# Altium project PCB1_Project.PrjPcb
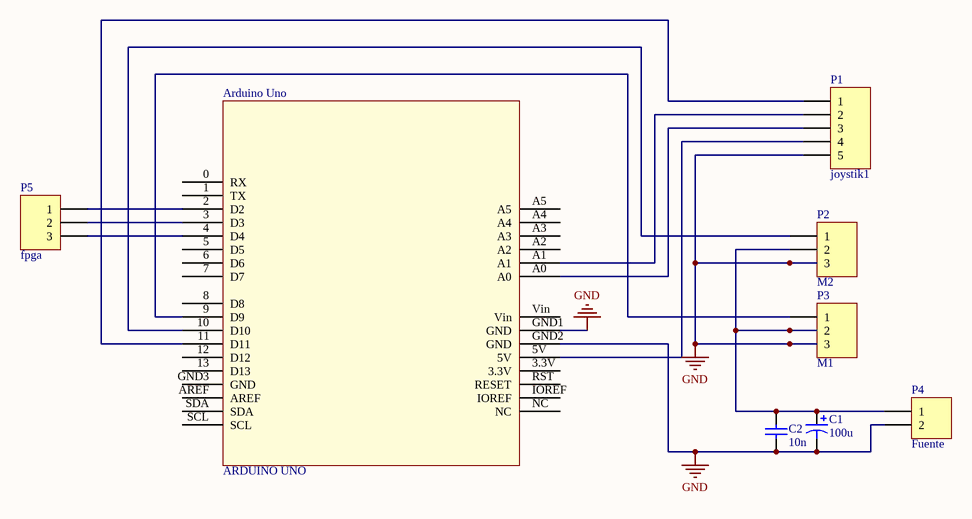
[diagram p0: Sheet1.SchDoc]
2 sheets, 15 parts. Net scope: flat (ports and power ports of the same name join across sheets).
Board files: PCB1.PcbDoc, PCB2.PcbDoc
Sheets:
  Sheet1.SchDoc
  Sheet2.SchDoc

## Sheet Sheet1.SchDoc
size A4; SheetNumber: 1; SheetTotal: 2

### Parts
Arduino_Uno  ARDUINO UNO  [ARDUINO UNO]
C1  value 100u  [CAP ELEC 10x16x5]  (hidden comment: Capacitor polarizado)
C2  value 10n  [Capacitor ceramico 0.2 inch pitch]  (hidden comment: Capacitor no polarizado)
P1  joystik1  [HDR1X5]
P2  M2  [HDR1X3]
P3  M1  [HDR1X3]
P4  Fuente  [HDR1X2]
P5  fpga  [HDR1X3]

### Nets
GND: Arduino_Uno.GND1(GND) Arduino_Uno.GND2(GND) C1.2 C2.1 P1.5 P2.3 P3.3 P4.2
NetArduino_Uno_2: Arduino_Uno.2(D2) P5.1
NetArduino_Uno_3: Arduino_Uno.3(D3) P5.2
NetArduino_Uno_4: Arduino_Uno.4(D4) P5.3
NetArduino_Uno_5V: Arduino_Uno.5V P1.4
NetArduino_Uno_9: Arduino_Uno.9(D9) P3.1
NetArduino_Uno_10: Arduino_Uno.10(D10) P2.1
NetArduino_Uno_11: Arduino_Uno.11(D11) P1.1
NetArduino_Uno_A0: Arduino_Uno.A0 P1.3
NetArduino_Uno_A1: Arduino_Uno.A1 P1.2
NetC1_1: C1.1 C2.2 P2.2 P3.2 P4.1

Not connected (* = marked no-connect by the designer): Arduino_Uno 0(RX) 1(TX) 3.3V 5(D5) 6(D6) 7(D7) 8(D8) 12(D12) 13(D13) A2 A3 A4 A5 AREF GND3(GND) IOREF NC RST(RESET) SCL SDA Vin

### Library data of the parts
P1 = Header 5: Header, 5-Pin; LatestRevisionDate: 17-Jul-2002; LatestRevisionNote: Re-released for DXP Platform.; Publisher: Altium Limited
P2 P3 P5 = Header 3: Header, 3-Pin; LatestRevisionDate: 17-Jul-2002; LatestRevisionNote: Re-released for DXP Platform.; Publisher: Altium Limited
P4 = Header 2: Header, 2-Pin; LatestRevisionDate: 17-Jul-2002; LatestRevisionNote: Re-released for DXP Platform.; Publisher: Altium Limited

## Sheet Sheet2.SchDoc
size A4; SheetNumber: 2; SheetTotal: 2
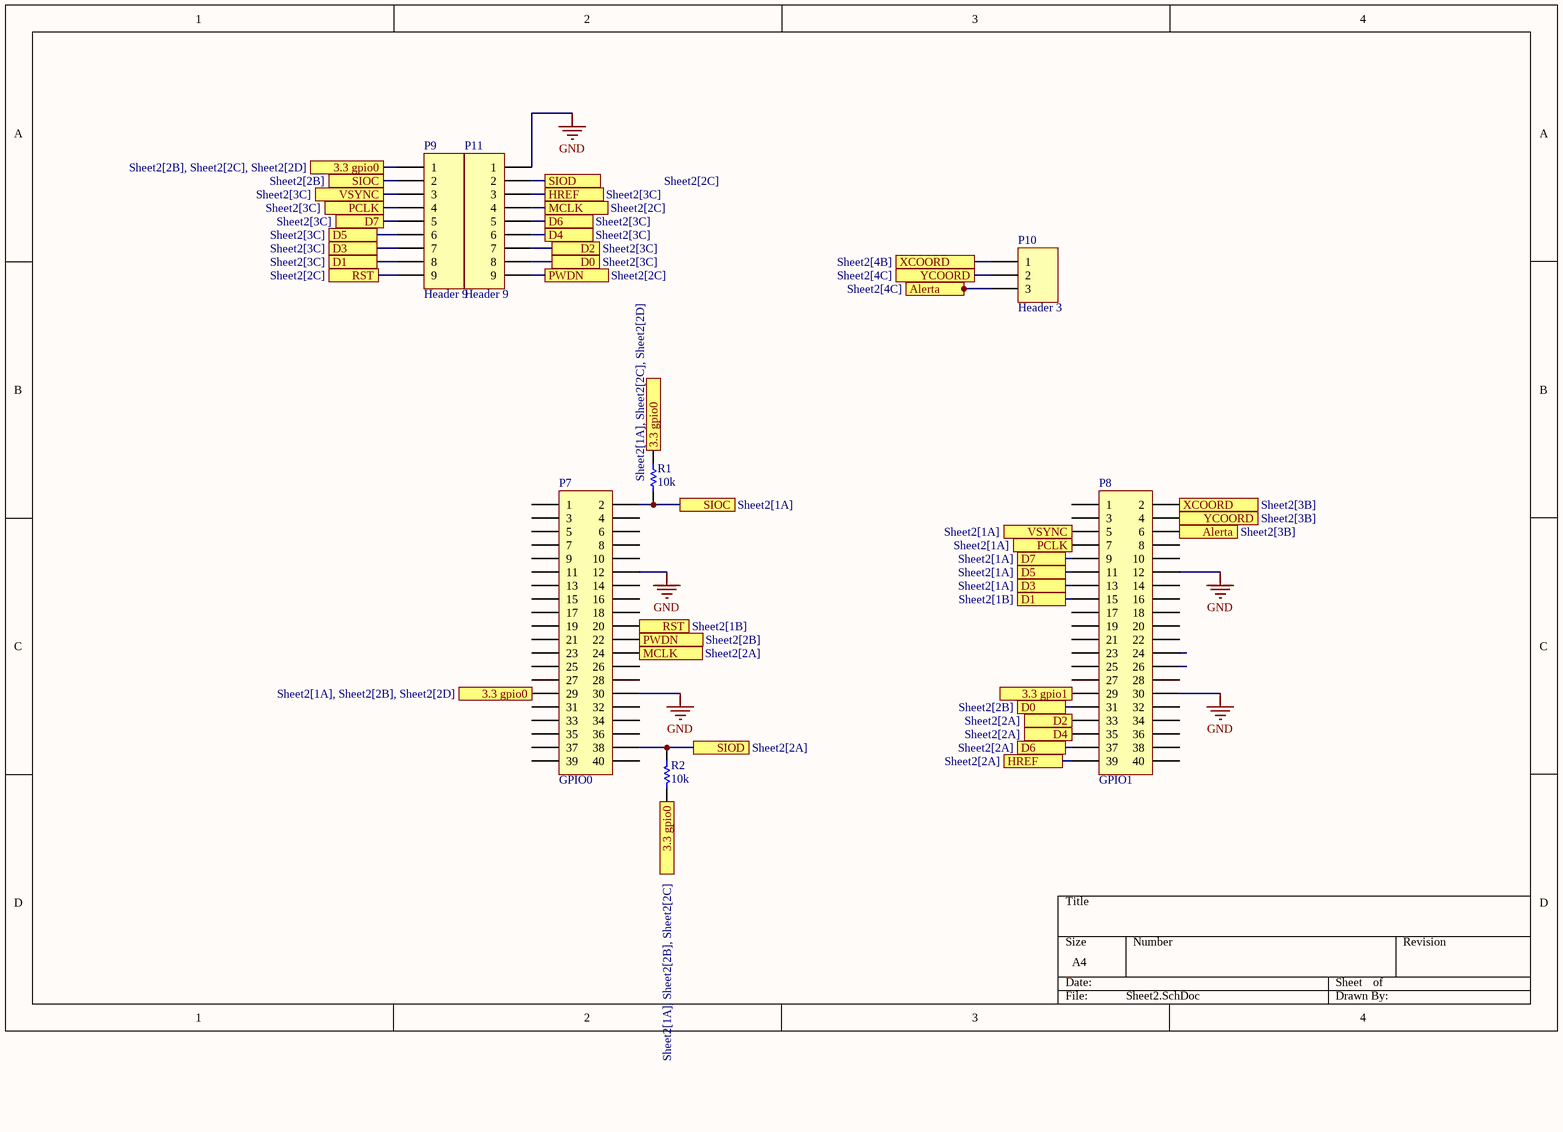
[diagram p1: Sheet2.SchDoc]

### Parts
P7  GPIO0  [HDR2X20]
P8  GPIO1  [HDR2X20]
P9  Header 9  [HDR1X9]
P10  Header 3  [HDR1X3]
P11  Header 9  [HDR1X9]
R1  value 10k  [RES 0.25 W - 0.4 In]  (hidden comment: Resistor)
R2  value 10k  [RES 0.25 W - 0.4 In]  (hidden comment: Resistor)

### Ports
3.3 gpio0 (see Sheet2[1A], Sheet2[2B], Sheet2[2C]), 3.3 gpio0 (see Sheet2[1A], Sheet2[2B], Sheet2[2D]), 3.3 gpio0 (see Sheet2[1A], Sheet2[2C], Sheet2[2D]), 3.3 gpio0 (see Sheet2[2B], Sheet2[2C], Sheet2[2D]), 3.3 gpio1, Alerta (see Sheet2[3B]), Alerta (see Sheet2[4C]), D0 (see Sheet2[2B]), D0 (see Sheet2[3C]), D1 (see Sheet2[1B]), D1 (see Sheet2[3C]), D2 (see Sheet2[2A]), D2 (see Sheet2[3C]), D3 (see Sheet2[1A]), D3 (see Sheet2[3C]), D4 (see Sheet2[2A]), D4 (see Sheet2[3C]), D5 (see Sheet2[1A]), D5 (see Sheet2[3C]), D6 (see Sheet2[2A]), D6 (see Sheet2[3C]), D7 (see Sheet2[1A]), D7 (see Sheet2[3C]), HREF (see Sheet2[2A]), HREF (see Sheet2[3C]), MCLK (see Sheet2[2A]), MCLK (see Sheet2[2C]), PCLK (see Sheet2[1A]), PCLK (see Sheet2[3C]), PWDN (see Sheet2[2B]), PWDN (see Sheet2[2C]), RST (see Sheet2[1B]), RST (see Sheet2[2C]), SIOC (see Sheet2[1A]), SIOC (see Sheet2[2B]), SIOD (see Sheet2[2A]), SIOD (see Sheet2[2C]), VSYNC (see Sheet2[1A]), VSYNC (see Sheet2[3C]), XCOORD (see Sheet2[3B]), XCOORD (see Sheet2[4B]), YCOORD (see Sheet2[3B]), YCOORD (see Sheet2[4C])

### Nets
GND: P7.12 P7.30 P8.12 P8.30 P11.1
NetP7_2: P7.2 P9.2 R1.1 ; port SIOC
NetP7_20: P7.20 P9.9 ; port RST
NetP7_22: P7.22 P11.9 ; port PWDN
NetP7_24: P7.24 P11.4 ; port MCLK
NetP7_29: P7.29 P9.1 R1.2 R2.2 ; port 3.3 gpio0
NetP7_38: P7.38 P11.2 R2.1 ; port SIOD
NetP8_2: P8.2 P10.1 ; port XCOORD
NetP8_4: P8.4 P10.2 ; port YCOORD
NetP8_5: P8.5 P9.3 ; port VSYNC
NetP8_6: P8.6 P10.3 ; port Alerta
NetP8_7: P8.7 P9.4 ; port PCLK
NetP8_9: P8.9 P9.5 ; port D7
NetP8_11: P8.11 P9.6 ; port D5
NetP8_13: P8.13 P9.7 ; port D3
NetP8_15: P8.15 P9.8 ; port D1
NetP8_29: P8.29 ; port 3.3 gpio1
NetP8_31: P8.31 P11.8 ; port D0
NetP8_33: P8.33 P11.7 ; port D2
NetP8_35: P8.35 P11.6 ; port D4
NetP8_37: P8.37 P11.5 ; port D6
NetP8_39: P8.39 P11.3 ; port HREF

Not connected (* = marked no-connect by the designer): P7 1 3 4 5 6 7 8 9 10 11 13 14 15 16 17 18 19 21 23 25 26 27 28 31 32 33 34 35 36 37 39 40; P8 1 3 8 10 14 16 17 18 19 20 21 22 23 24 25 26 27 28 32 34 36 38 40

### Library data of the parts
P7 P8 = Header 20X2: Header, 20-Pin, Dual row; LatestRevisionDate: 17-Jul-2002; LatestRevisionNote: Re-released for DXP Platform.; Publisher: Altium Limited
P9 P11 = Header 9: Header, 9-Pin; LatestRevisionDate: 17-Jul-2002; LatestRevisionNote: Re-released for DXP Platform.; Publisher: Altium Limited
P10 = Header 3: Header, 3-Pin; LatestRevisionDate: 17-Jul-2002; LatestRevisionNote: Re-released for DXP Platform.; Publisher: Altium Limited

## Nets that join several sheets
GND: Sheet1 (8 pins), Sheet2 (5 pins)